# EAGLE design Wash Basin Indicator (EAGLE 9.3.1)
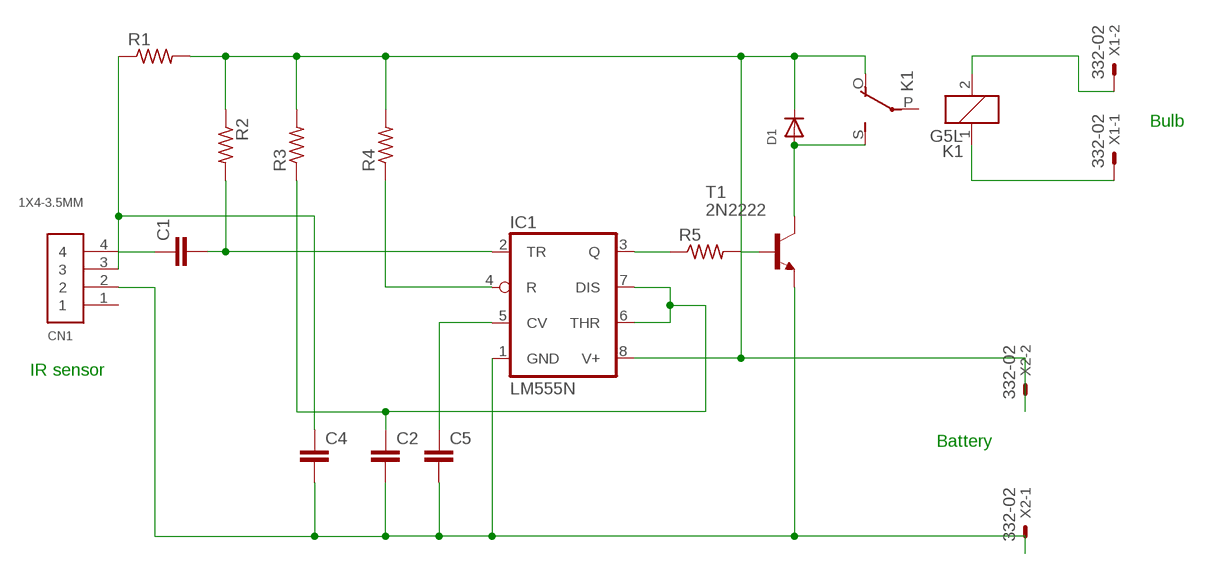
[diagram p0: schematic, sheet 1]

## Parts
C1  C5/3.5  [C5B3.5]
C2  C5/3.5  [C5B3.5]
C4  C5/3.5  [C5B3.5]
C5  C5/3.5  [C5B3.5]
CN1  1X4-3.5MM  [1X04-3.5MM]
D1  DIODEDO-1N4148  [DO-1N4148]
IC1  LM555N  [DIL08]
K1  G5L  [G5LE]
R1  R-US_0204/7  [0204/7]
R2  R-US_0204/7  [0204/7]
R3  R-US_0204/7  [0204/7]
R4  R-US_0204/7  [0204/7]
R5  R-US_0204/7  [0204/7]
T1  2N2222  [TO92-EBC-OVAL]
X1  332-02  [332-02]
X2  332-02  [332-02]

## Nets
N$1: D1.C IC1.8(V+) K1.O(2:O) R1.2 R2.1 R3.2 R4.2 X2.2
N$2: IC1.4(R) R4.1
N$3: C1.2 IC1.2(TR) R2.2
N$4: C1.1 CN1.4
N$5: C2.2 C4.2 C5.2 CN1.2 IC1.1(GND) T1.E X2.1
N$6: C4.1 CN1.3 R1.1
N$7: IC1.3(Q) R5.1
N$8: R5.2 T1.B
N$9: D1.A K1.S(2:S) T1.C
N$10: C5.1 IC1.5(CV)
N$11: K1.2 X1.2
N$12: C2.1 IC1.6(THR) IC1.7(DIS) R3.1
N$13: K1.1 X1.1
Unconnected: CN1.1 K1.P(2:P)

## Notes on the sheet
- Bulb
- IR sensor
- Battery

## Library data of the parts
C1 C2 C4 C5 = capacitor-wima:C: CAPACITOR naming: grid - package width
CN1 = adafruit:1X4: 4-pin connector
D1 = adafruit:DIODE: Diode SMADIODE - SMA Surface Mount Package 20V 1A Schottky Diode Digikey: 641-1014-6-ND DO-1N4148 - Through Hole Small Current Diode SOD-123 20V 1 A (.5mV Vf) Schottky Diode - Digikey: MBRX120TPMSCT-ND SOD-323 10V 570mA (.38mV Vf, 3ns) Schottky Diode - Digikey: ZLLS410CT-ND SOD-523 30V 30mA Schottky Diode (RB751S-40TE61) - Digikey: RB751S-40TE61CT-ND SOT23-R/W - SOT23 Package (R = Solder Paste/Reflow Ovens, W = Hand-Soldering) BAT54Film 40V 300mA - Digikey: 497-7162-1-ND
IC1 = linear:*555: TIMER
K1 = relay:G5L: RELAY 1 x switch, 10 A/120 V AC, 8 A/30 V ADC, Omron; OC_FARNELL: unknown; OC_NEWARK: unknown
R1-R5 = adafruit:R-US_: RESISTOR, American symbol
T1 = adafruit:2N2222: NPN TRANSISTOR Big oval pads
X1 X2 = con-garry:332-02: 2 Pin - 2mm Dual Row Source: www.mpe-connector.de / garry_shortform_2012.pdf

## Board
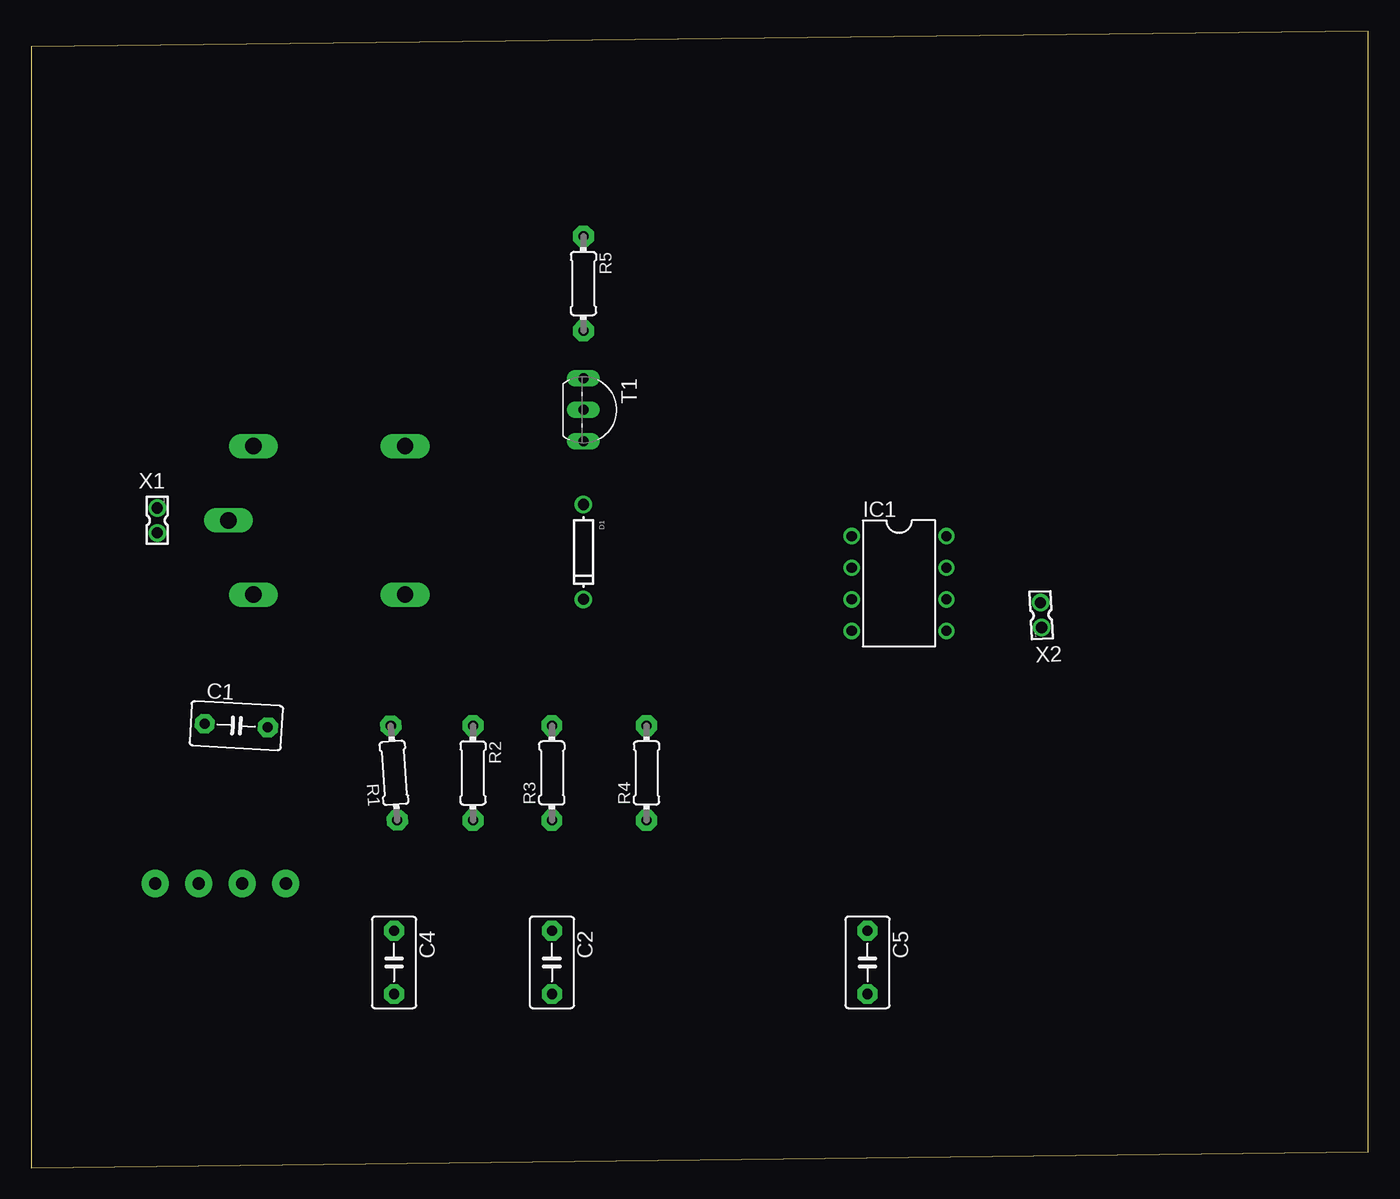
[diagram p1: board, top side]
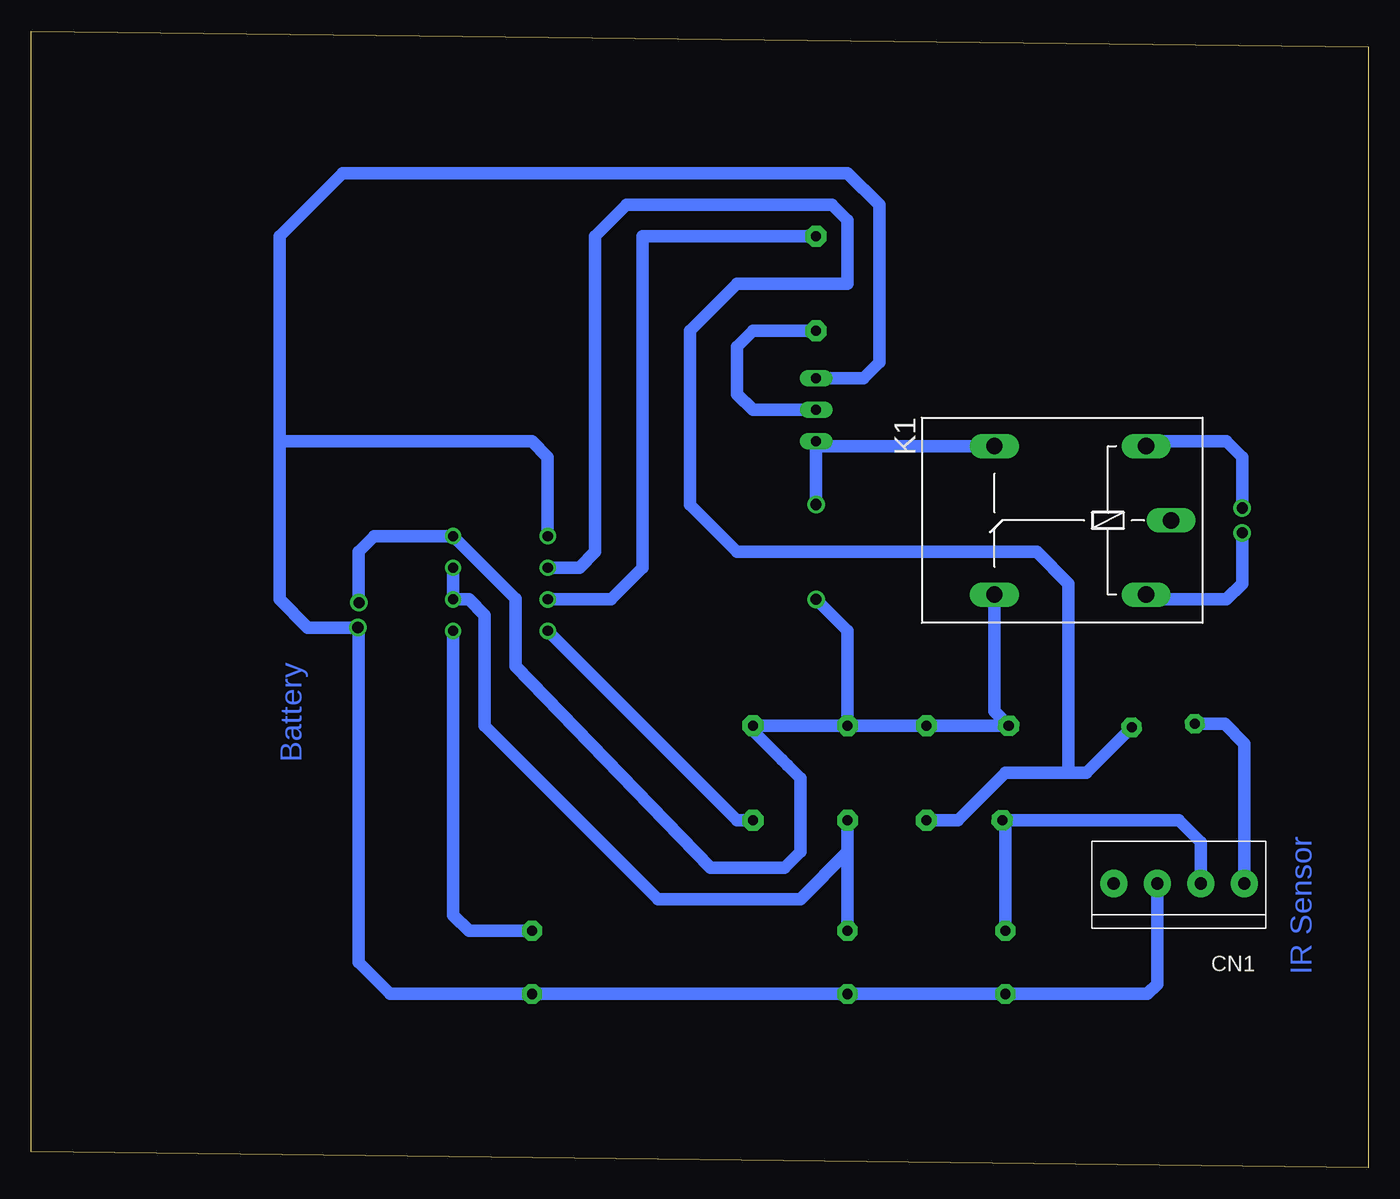
[diagram p2: board, bottom side, seen from below]

Size 107.62 x 91.43 mm. Coordinates in mm from the lower left corner, seen from the top.
Outline: 0,0 107.62,1.27 107.62,91.43 0,90.16 0,0
Copper layers (1*16): Top 0.035mm / dielectric 1.5mm / Bottom 0.035mm
Design rules "default": minimum track width 6mil, minimum drill 0.35mm, track to track 6mil, track to pad 6mil, pad to pad 6mil, via to via 6mil, smd to smd 6mil, copper to edge 40mil, drill to drill 6mil, minimum pad ring 10mil, minimum via ring 8mil, stop-mask expansion 4mil, vias tented up to drill 0mil, thermal gap 10mil

### Footprints (pad centres in the part's own frame; a part is rotated, then mirrored left to right if it is on the bottom)
C5B3.5 = drill 0.813 pad 1.6 octagon: 1 -2.54,0; 2 2.54,0
1X04-3.5MM = drill 1 pad 2.184: 1 -5.25,0; 2 -1.75,0; 3 1.75,0; 4 5.25,0
DO-1N4148 = drill 0.9: A -3.81,0; C 3.81,0
DIL08 = drill 0.813 pad 1.27: 1 -3.81,-3.81; 2 -1.27,-3.81; 3 1.27,-3.81; 4 3.81,-3.81; 5 3.81,3.81; 6 1.27,3.81; 7 -1.27,3.81; 8 -3.81,3.81
G5LE = drill 1.321 long: 1 -7.493,-5.969; 2 -7.493,5.969; O 4.699,5.969; P -9.525,0; S 4.699,-5.969
0204/7 = drill 0.813 pad 1.676 octagon: 1 -3.81,0; 2 3.81,0
TO92-EBC-OVAL = drill 0.813 long: B 0,-1.27; C 2.54,-1.27; E -2.54,-1.27
332-02 = drill 0.9 pad 1.27: 1 0,-1; 2 0,1

### Placement (x,y rotation side)
C1  16.51,35.56 356.7 top
C2  41.91,16.51 270 top
C4  29.21,16.51 270 top
C5  67.31,16.51 270 top
CN1  15.24,22.86 0 bottom
D1  44.45,49.53 270 top
IC1  69.85,46.99 270 top
K1  25.4,52.07 180 bottom
R1  29.21,31.75 93.9 top
R2  35.56,31.75 270 top
R3  41.91,31.75 90 top
R4  49.53,31.75 90 top
R5  44.45,71.12 270 top
T1  45.72,60.96 270 top
X1  10.16,52.07 180 top
X2  81.28,44.45 2.7 top

### Tracks (layer width: path | path; a pad name or v marks a point on that pad's centre or on a via)
N$1
  Bottom 1.016: R1.2 | R1.2 R2.1 R3.2 | R3.2 R4.2 49.53,35.14 47.2,32.81 46.76,32.37 45.72,31.33 45.72,25.4 47.01,24.11 52.94,24.11 68.63,40.35 68.63,45.77 IC1.8 80.01,50.8 81.28,49.53 81.28,45.5 X2.2 | K1.O 30.1,36.7 R1.2 | R3.2 41.91,43.18 D1.C
N$2
  Bottom 1.016: R4.1 50.8,27.94 IC1.4
N$3
  Bottom 1.016: R2.2 33.02,27.94 29.21,31.75 24.13,31.75 | C1.2 22.71,31.75 24.13,31.75 | IC1.2 63.5,48.26 62.23,49.53 62.23,74.93 59.69,77.47 43.18,77.47 41.91,76.2 41.91,71.12 50.8,71.12 54.61,67.31 54.61,53.34 50.8,49.53 26.67,49.53 24.13,46.99 24.13,31.75
N$4
  Bottom 1.016: CN1.4 9.99,34.12 11.58,35.71 C1.1
N$5
  Bottom 1.016: CN1.2 16.99,14.76 17.78,13.97 C4.2 C2.2 C5.2 78.74,13.97 81.28,16.51 81.28,43.4 X2.1 85.36,43.45 87.63,45.72 87.63,58.42 | 87.63,58.42 87.63,74.93 82.55,80.01 41.91,80.01 39.37,77.47 39.37,64.77 40.64,63.5 T1.E | IC1.1 66.04,57.15 67.31,58.42 87.63,58.42
N$6
  Bottom 1.016: CN1.3 13.49,26.19 15.24,27.94 29.21,27.94 | 29.21,27.94 29.22,27.95 R1.1 | C4.1 29.21,27.94
N$7
  Bottom 1.016: IC1.3 60.96,45.72 58.42,48.26 58.42,74.93 R5.1
N$8
  Bottom 1.016: R5.2 49.53,67.31 50.8,66.04 50.8,62.23 49.53,60.96 T1.B
N$9
  Bottom 1.016: K1.S 44.07,58.04 T1.C D1.A
N$10
  Bottom 1.016: IC1.5 73.66,20.32 72.39,19.05 C5.1
N$11
  Bottom 1.016: X1.2 10.16,46.99 11.43,45.72 17.53,45.72 K1.2
N$12
  Bottom 1.016: C2.1 R3.1 41.91,25.4 45.72,21.59 57.15,21.59 71.12,35.56 71.12,44.45 72.39,45.72 IC1.6 IC1.7
N$13
  Bottom 1.016: X1.1 10.16,57.15 11.43,58.42 17.78,58.42 17.78,58.17 K1.1

### Text on the board
Bottom: Battery | IR Sensor